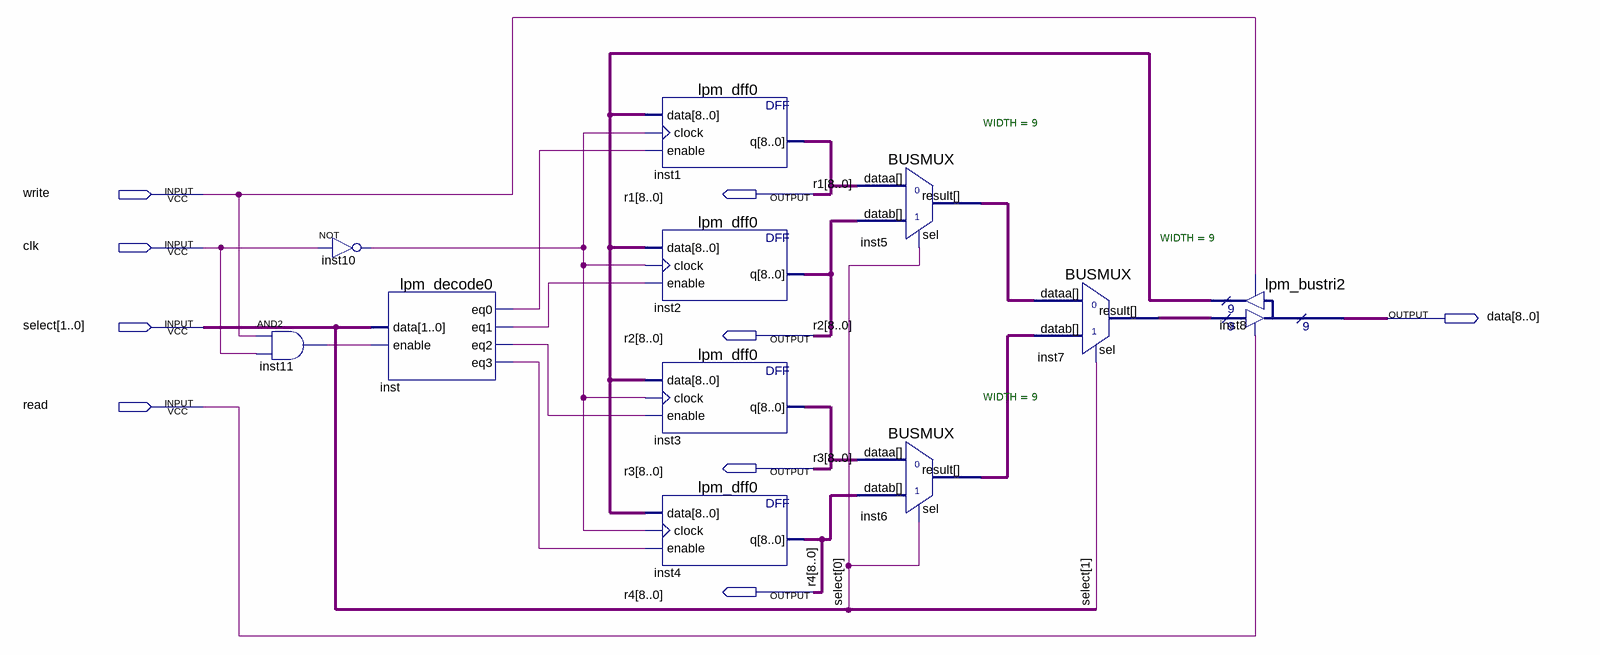
[diagram p0: schematic sheet]
// Quartus schematic gpr.bdf as structural Verilog: 11 symbols, 9 pins
module gpr (
  input  write,
  input  clk,
  input  [1:0] select,
  input  read,
  output [8:0] r1,
  output [8:0] data,
  output [8:0] r2,
  output [8:0] r3,
  output [8:0] r4
);

  wire inst10_out, inst11_out, inst_eq0, inst_eq1, inst_eq2, inst_eq3;
  wire [8:0] inst5_result, inst6_result, inst7_result, inst8_result;

  and inst11 (inst11_out, write, clk);
  not inst10 (inst10_out, clk);
  lpm_decode0 inst (.data(select), .enable(inst11_out), .eq0(inst_eq0), .eq1(inst_eq1), .eq2(inst_eq2), .eq3(inst_eq3));
  lpm_dff0 inst1 (.data(inst8_result), .clock(inst10_out), .enable(inst_eq0), .q(r1));
  lpm_dff0 inst2 (.data(inst8_result), .clock(inst10_out), .enable(inst_eq1), .q(r2));
  lpm_dff0 inst3 (.data(inst8_result), .clock(inst10_out), .enable(inst_eq2), .q(r3));
  lpm_dff0 inst4 (.data(inst8_result), .clock(inst10_out), .enable(inst_eq3), .q(r4));
  BUSMUX #(.WIDTH(9)) inst5 (.datab(r2), .sel(select[0]), .dataa(r1), .result(inst5_result));
  BUSMUX #(.WIDTH(9)) inst6 (.datab(r4), .sel(select[0]), .dataa(r3), .result(inst6_result));
  BUSMUX #(.WIDTH(9)) inst7 (.datab(inst6_result), .sel(select[1]), .dataa(inst5_result), .result(inst7_result));
  lpm_bustri2 inst8 (.enabledt(read), .data(inst7_result), .enabletr(write), .result(inst8_result), .tridata(data));
endmodule
